# EasyEDA Pro project ProPrj_Custom Keyboard_2025-10-10.epro, board PCB
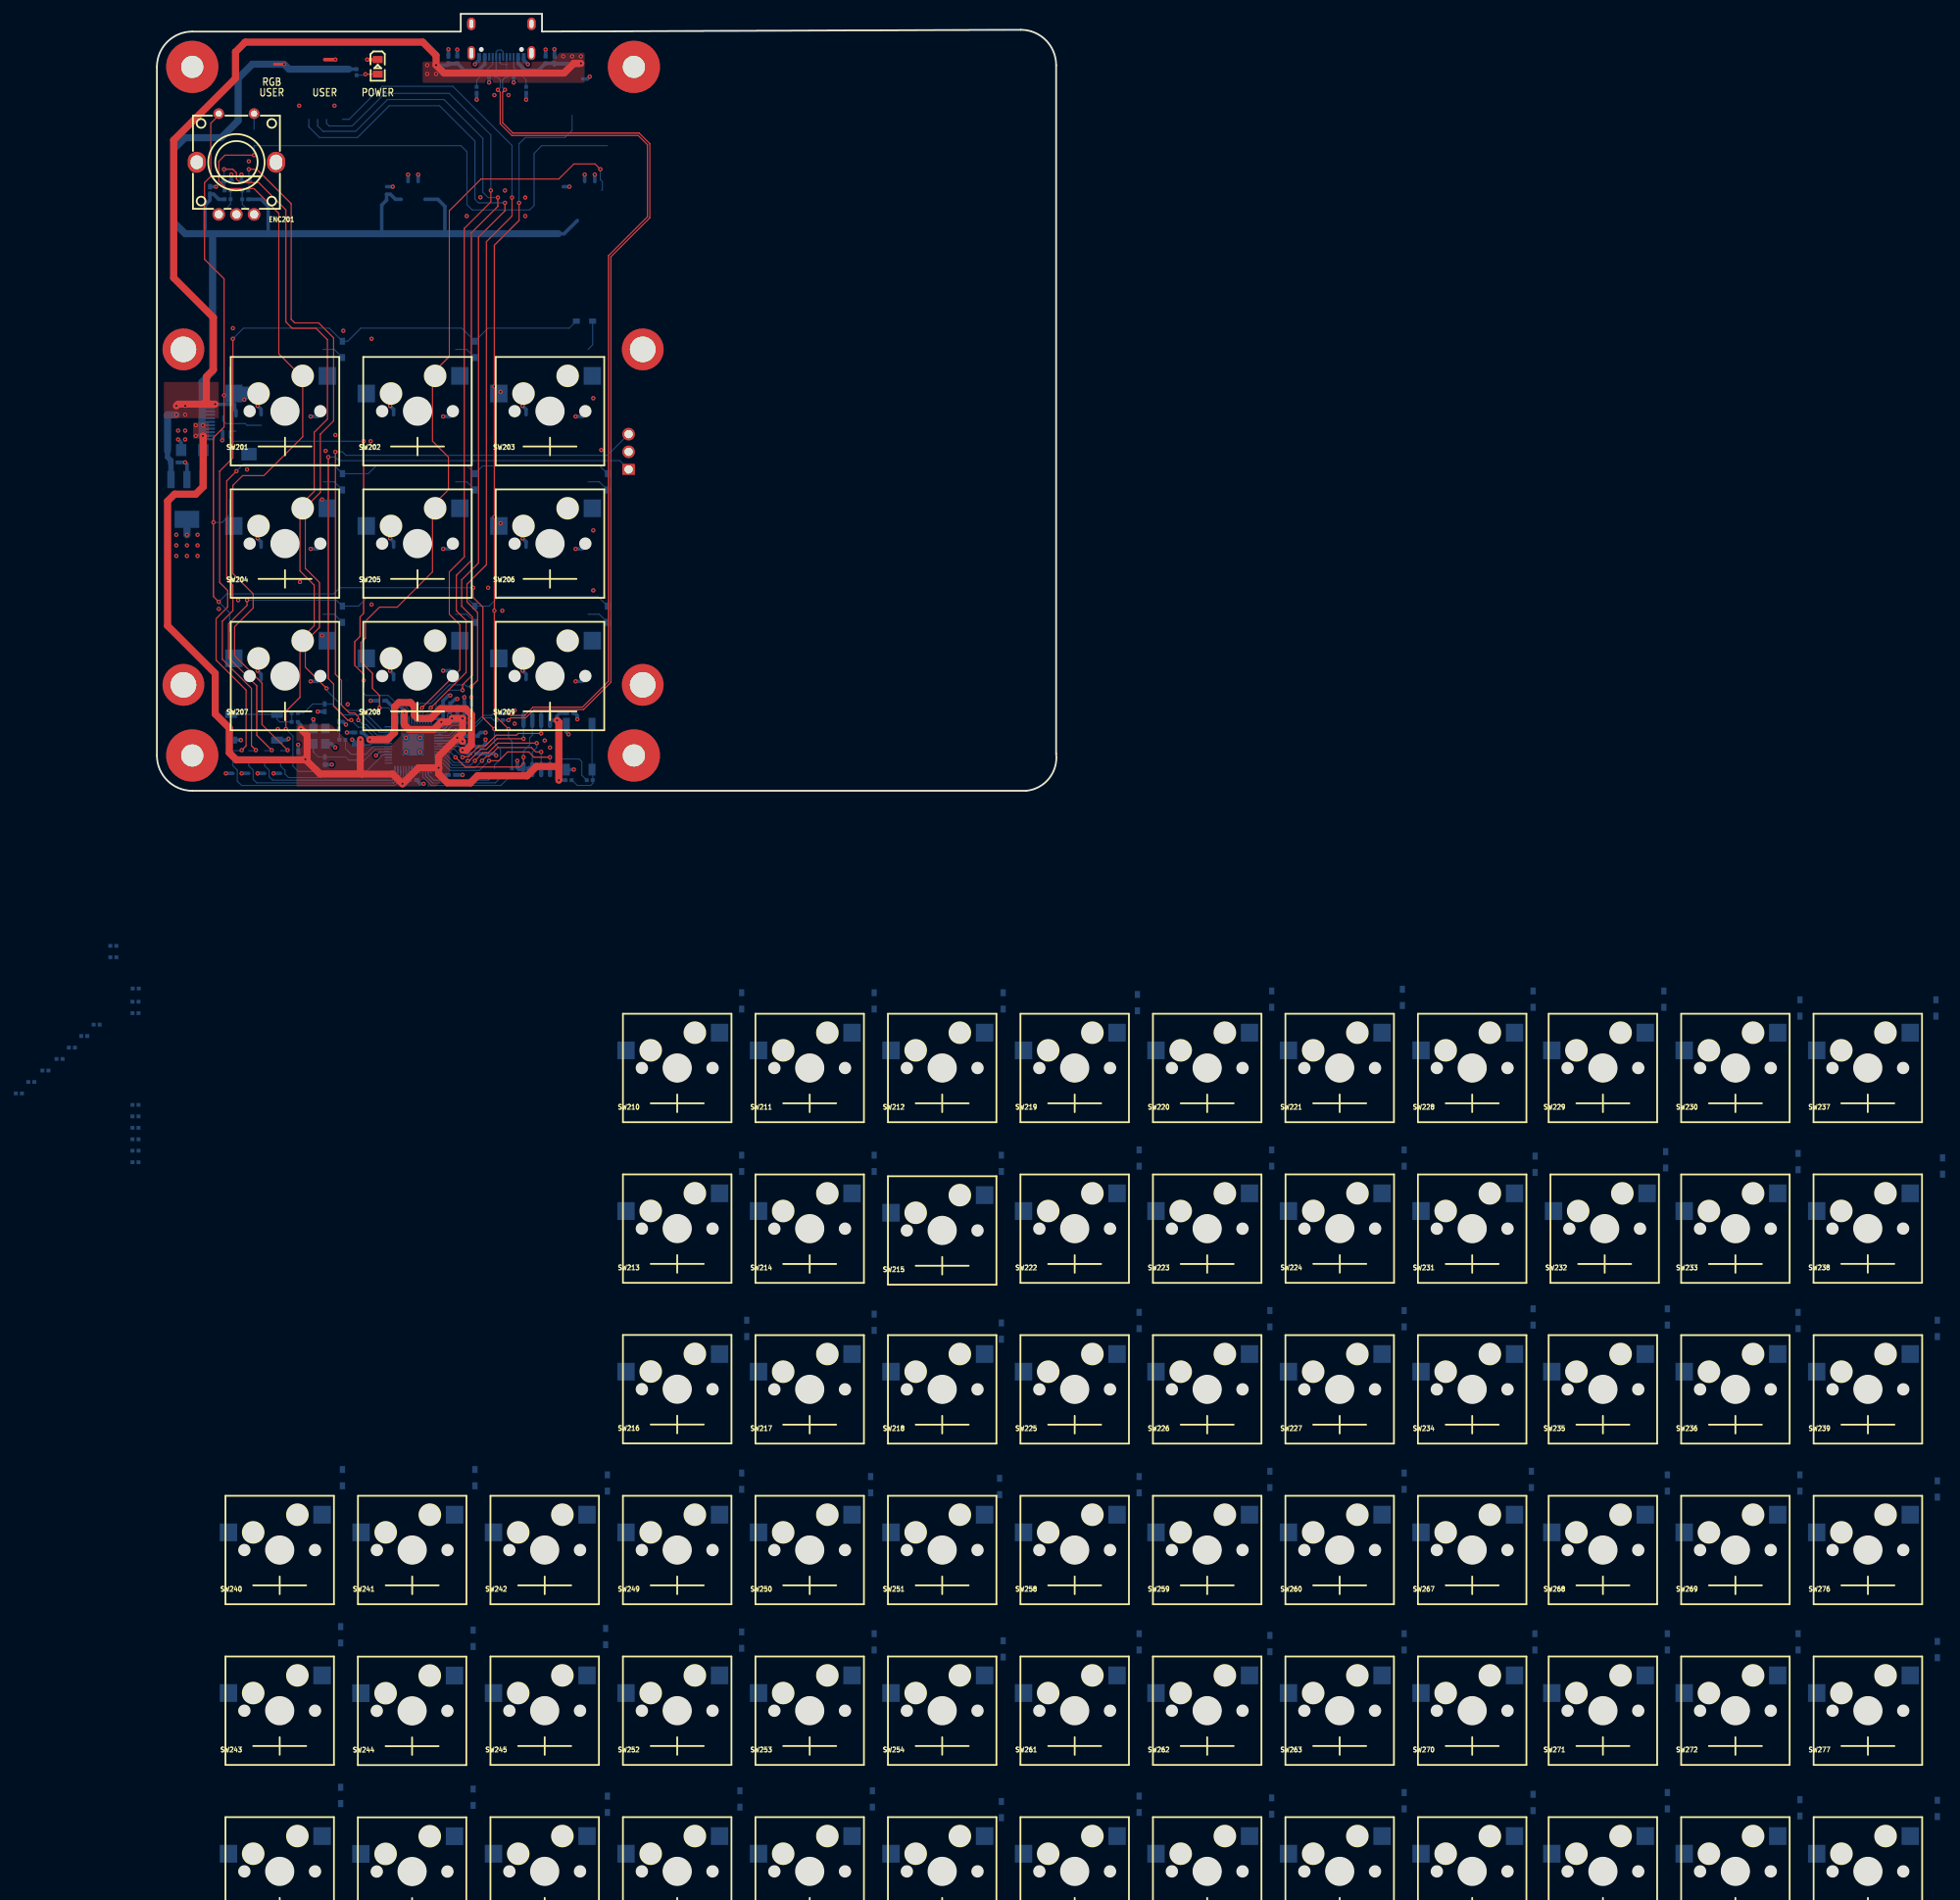
[diagram p2: board, top side]
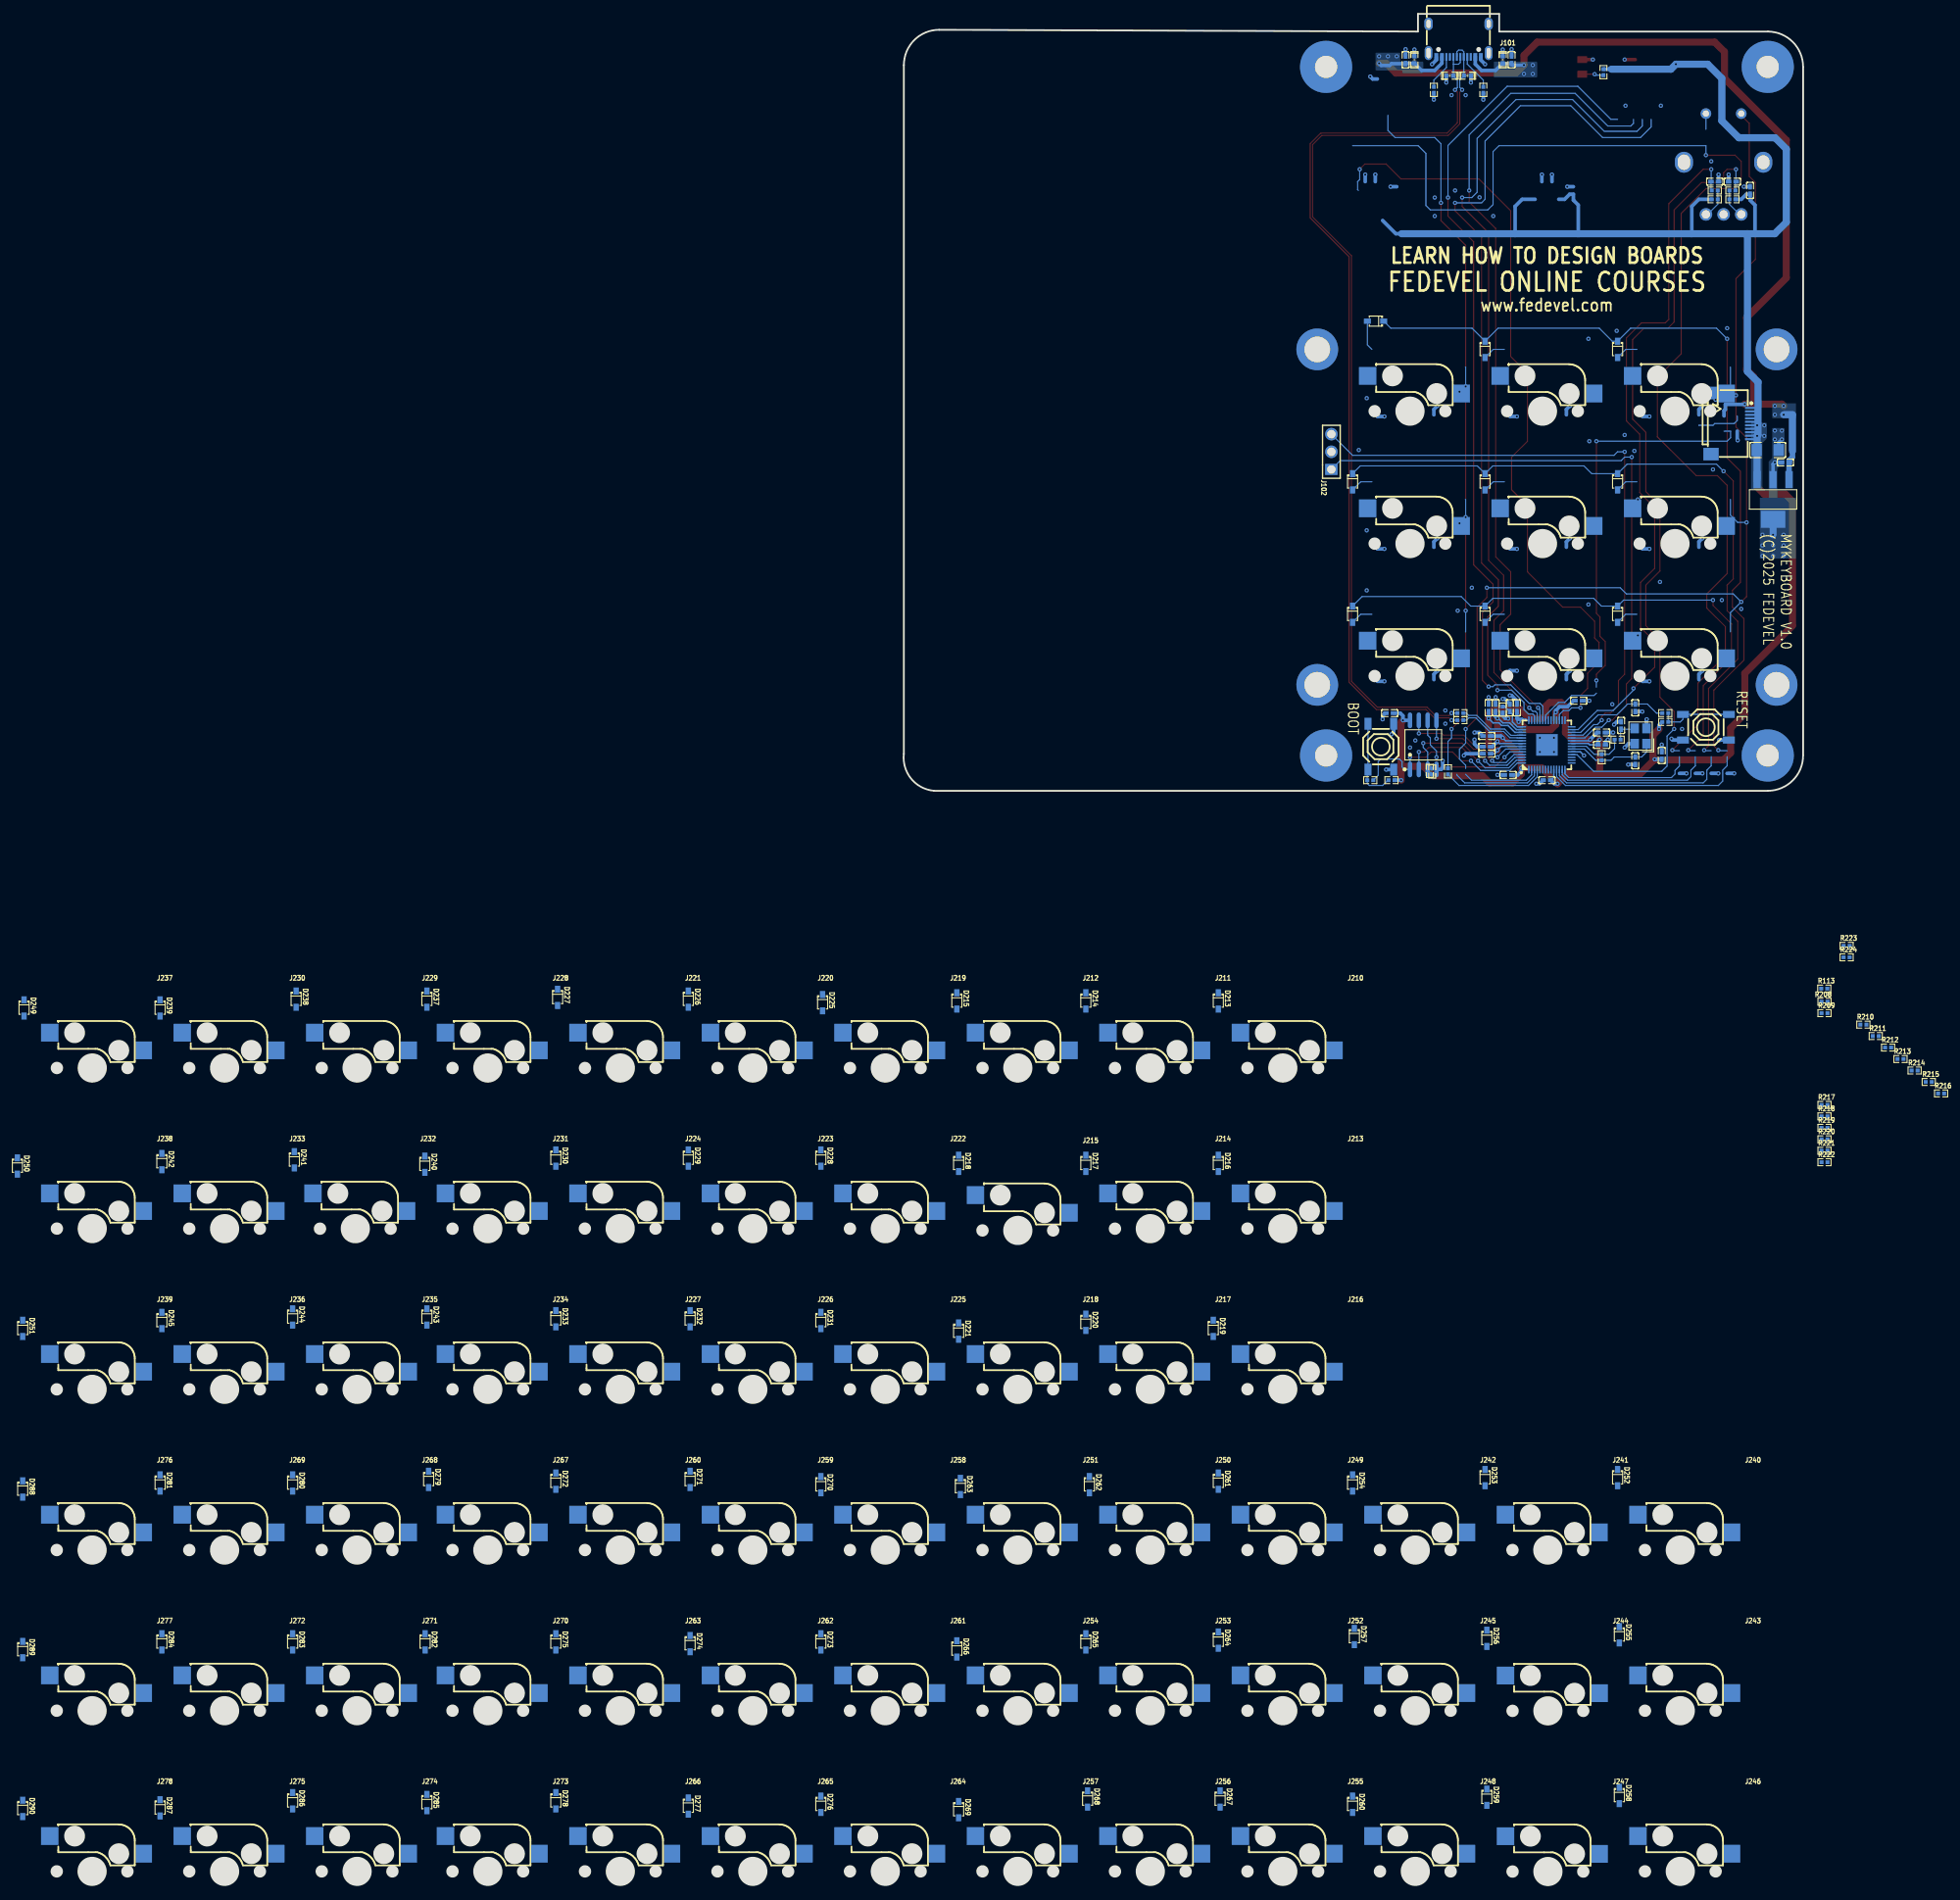
[diagram p3: board, bottom side, seen from below]

Outline 251.96 x 269.33 mm; copper layers: Top Layer, Inner1, Inner2, Bottom Layer. Coordinates in mm from the lower left corner of the outline.
Outline path: 0,261.71 0,162.65 arc(1.49,159.05) 5.08,157.57 124.97,157.57 arc(128.25,159.32) 129.29,162.9 129.29,261.96 arc(127.8,265.55) 124.21,267.04 55.37,266.79 55.37,269.33 43.69,269.33 43.69,266.79 5.08,266.79 arc(1.49,265.3) 0,261.71
Stack: Top Layer 0.035mm Outer layer copper thickness 1oz / Dielectric1 0.2104mm 7628 RC49% 8.6mil / Inner1 0.0152mm Inner layer copper thickness / Dielectric2 1.065mm 1.1mm H/HOZ Copper / Inner2 0.0152mm Inner layer copper thickness / Dielectric3 0.2104mm 7628 RC49% 8.6mil / Bottom Layer 0.035mm Outer layer copper thickness 1oz

## Design rules (mm)
net CON_USB_N: USB_CON
net CON_USB_P: USB_CON
net USB_N: USB
net USB_P: USB
template: User Custom Config
spacing copperThickness1oz (default): track to track 0.178, other pairs 0.076 to 0.305
spacing copperThickness2oz: track to track 0.203, other pairs 0.152 to 0.3
spacing copperThicknessInner0.5oz: track to track 0.089, other pairs 0.152 to 0.3
track width copperThickness1oz (default): min 0.152, default 0.203, max 2.54
track width copperThickness2oz: min 0.203, default 0.254, max 2.54
track width copperThickness0.5oz: min 0.089, default 0.254, max 2.54
differential pair differentialPair (default): width min 0.155, default 0.155, max 0.203; gap min 0.178, default 0.191
via viaSize (default): diameter min 0.61, default 0.61, max 10; hole min 0.305, default 0.305, max 6.299

## Placement (name value [footprint] x y rotation side)
C101  2.2uF  [C0402]  20.32 162.65 270 bottom
C102  100nF  [C0402]  45.47 165.44 180 bottom
C103  100nF  [C0402]  45.47 163.92 180 bottom
C104  100nF  [C0402]  41.15 169.5 270 bottom
C105  2.2uF  [C0402]  42.16 169.5 270 bottom
C106  2.2uF  [C0402]  44.2 169.5 270 bottom
C107  2.2uF  [C0402]  45.21 169.5 270 bottom
C108  100nF  [C0402]  45.47 162.9 180 bottom
C109  100nF  [C0402]  28.96 165.95 0 bottom
C111  1uF  [C0402]  2.54 204.81 180 bottom
C112  47uF  [C1206]  5.08 206.59 0 bottom
C113  100nF  [C0402]  32.26 170.52 0 bottom
C114  100nF  [C0402]  28.96 164.17 0 bottom
C115  100nF  [C0402]  36.83 159.09 180 bottom
C116  100nF  [C0402]  42.42 159.85 180 bottom
C118  1uF  [C0402]  41.91 262.72 270 bottom
C119  1uF  [C0402]  57.15 262.72 270 bottom
C123  15pF  [C0402]  24.13 161.88 270 bottom
C124  15pF  [C0402]  26.16 166.96 90 bottom
C126  100nF  [C0402]  59.44 168.74 180 bottom
C127  100nF  [C0402]  24.13 169.5 90 bottom
C201  2.2uF  [C0402]  7.62 243.93 270 bottom
C203  10nF  [C0402]  10.16 245.2 180 bottom
C204  10nF  [C0402]  12.7 245.2 0 bottom
D101  GG0402052R542P  [D0402-BI]  43.18 262.72 270 bottom
D102  GG0402052R542P  [D0402-BI]  55.88 262.72 270 bottom
D103  GG0402052R542P  [D0402-BI]  48.26 260.44 0 bottom
D104  GG0402052R542P  [D0402-BI]  50.8 260.44 180 bottom
D201  1N5819WS  [SOD-323_L1.8-W1.3-LS2.5-RD]  26.67 221.07 270 bottom
D202  1N5819WS  [SOD-323_L1.8-W1.3-LS2.5-RD]  45.72 221.07 270 bottom
D203  1N5819WS  [SOD-323_L1.8-W1.3-LS2.5-RD]  61.47 225.13 0 bottom
D204  1N5819WS  [SOD-323_L1.8-W1.3-LS2.5-RD]  26.67 202.02 270 bottom
D205  1N5819WS  [SOD-323_L1.8-W1.3-LS2.5-RD]  45.72 202.02 270 bottom
D206  1N5819WS  [SOD-323_L1.8-W1.3-LS2.5-RD]  64.77 202.02 270 bottom
D207  1N5819WS  [SOD-323_L1.8-W1.3-LS2.5-RD]  26.67 182.97 270 bottom
D208  1N5819WS  [SOD-323_L1.8-W1.3-LS2.5-RD]  45.72 182.97 270 bottom
D209  1N5819WS  [SOD-323_L1.8-W1.3-LS2.5-RD]  64.77 182.97 270 bottom
D213  1N5819WS  [SOD-323_L1.8-W1.3-LS2.5-RD]  84.07 127.34 270 bottom
D214  1N5819WS  [SOD-323_L1.8-W1.3-LS2.5-RD]  103.12 127.34 270 bottom
D215  1N5819WS  [SOD-323_L1.8-W1.3-LS2.5-RD]  121.67 127.34 270 bottom
D216  1N5819WS  [SOD-323_L1.8-W1.3-LS2.5-RD]  84.07 103.97 270 bottom
D217  1N5819WS  [SOD-323_L1.8-W1.3-LS2.5-RD]  103.12 103.97 270 bottom
D218  1N5819WS  [SOD-323_L1.8-W1.3-LS2.5-RD]  121.41 103.97 270 bottom
D219  1N5819WS  [SOD-323_L1.8-W1.3-LS2.5-RD]  84.8 80.23 270 bottom
D220  1N5819WS  [SOD-323_L1.8-W1.3-LS2.5-RD]  103.12 81.11 270 bottom
D221  1N5819WS  [SOD-323_L1.8-W1.3-LS2.5-RD]  121.41 79.84 270 bottom
D225  1N5819WS  [SOD-323_L1.8-W1.3-LS2.5-RD]  140.97 127.09 270 bottom
D226  1N5819WS  [SOD-323_L1.8-W1.3-LS2.5-RD]  160.27 127.59 270 bottom
D227  1N5819WS  [SOD-323_L1.8-W1.3-LS2.5-RD]  179.07 127.85 270 bottom
D228  1N5819WS  [SOD-323_L1.8-W1.3-LS2.5-RD]  141.22 104.73 270 bottom
D229  1N5819WS  [SOD-323_L1.8-W1.3-LS2.5-RD]  160.27 104.73 270 bottom
D230  1N5819WS  [SOD-323_L1.8-W1.3-LS2.5-RD]  179.32 104.73 270 bottom
D231  1N5819WS  [SOD-323_L1.8-W1.3-LS2.5-RD]  141.22 81.37 270 bottom
D232  1N5819WS  [SOD-323_L1.8-W1.3-LS2.5-RD]  160.02 81.62 270 bottom
D233  1N5819WS  [SOD-323_L1.8-W1.3-LS2.5-RD]  179.32 81.62 270 bottom
D237  1N5819WS  [SOD-323_L1.8-W1.3-LS2.5-RD]  197.87 127.59 270 bottom
D238  1N5819WS  [SOD-323_L1.8-W1.3-LS2.5-RD]  216.66 127.59 270 bottom
D239  1N5819WS  [SOD-323_L1.8-W1.3-LS2.5-RD]  236.22 126.32 270 bottom
D240  1N5819WS  [SOD-323_L1.8-W1.3-LS2.5-RD]  198.16 103.84 270 bottom
D241  1N5819WS  [SOD-323_L1.8-W1.3-LS2.5-RD]  216.92 104.48 270 bottom
D242  1N5819WS  [SOD-323_L1.8-W1.3-LS2.5-RD]  235.97 104.23 270 bottom
D243  1N5819WS  [SOD-323_L1.8-W1.3-LS2.5-RD]  197.87 81.87 270 bottom
D244  1N5819WS  [SOD-323_L1.8-W1.3-LS2.5-RD]  217.17 81.87 270 bottom
D245  1N5819WS  [SOD-323_L1.8-W1.3-LS2.5-RD]  235.97 81.37 270 bottom
D249  1N5819WS  [SOD-323_L1.8-W1.3-LS2.5-RD]  255.78 126.32 270 bottom
D250  1N5819WS  [SOD-323_L1.8-W1.3-LS2.5-RD]  256.74 103.59 270 bottom
D251  1N5819WS  [SOD-323_L1.8-W1.3-LS2.5-RD]  255.98 80.23 270 bottom
D252  1N5819WS  [SOD-323_L1.8-W1.3-LS2.5-RD]  26.67 58.76 270 bottom
D253  1N5819WS  [SOD-323_L1.8-W1.3-LS2.5-RD]  45.72 58.76 270 bottom
D254  1N5819WS  [SOD-323_L1.8-W1.3-LS2.5-RD]  64.77 58 270 bottom
D255  1N5819WS  [SOD-323_L1.8-W1.3-LS2.5-RD]  26.42 36.15 270 bottom
D256  1N5819WS  [SOD-323_L1.8-W1.3-LS2.5-RD]  45.47 35.65 270 bottom
D257  1N5819WS  [SOD-323_L1.8-W1.3-LS2.5-RD]  64.52 35.9 270 bottom
D258  1N5819WS  [SOD-323_L1.8-W1.3-LS2.5-RD]  26.42 13.04 270 bottom
D259  1N5819WS  [SOD-323_L1.8-W1.3-LS2.5-RD]  45.47 12.79 270 bottom
D260  1N5819WS  [SOD-323_L1.8-W1.3-LS2.5-RD]  64.77 11.77 270 bottom
D261  1N5819WS  [SOD-323_L1.8-W1.3-LS2.5-RD]  84.07 58.25 270 bottom
D262  1N5819WS  [SOD-323_L1.8-W1.3-LS2.5-RD]  102.62 57.74 270 bottom
D263  1N5819WS  [SOD-323_L1.8-W1.3-LS2.5-RD]  121.16 57.49 270 bottom
D264  1N5819WS  [SOD-323_L1.8-W1.3-LS2.5-RD]  84.07 35.39 270 bottom
D265  1N5819WS  [SOD-323_L1.8-W1.3-LS2.5-RD]  103.12 35.14 270 bottom
D266  1N5819WS  [SOD-323_L1.8-W1.3-LS2.5-RD]  121.67 34.12 270 bottom
D267  1N5819WS  [SOD-323_L1.8-W1.3-LS2.5-RD]  83.82 12.53 270 bottom
D268  1N5819WS  [SOD-323_L1.8-W1.3-LS2.5-RD]  102.87 12.53 270 bottom
D269  1N5819WS  [SOD-323_L1.8-W1.3-LS2.5-RD]  121.41 11.01 270 bottom
D270  1N5819WS  [SOD-323_L1.8-W1.3-LS2.5-RD]  141.22 57.74 270 bottom
D271  1N5819WS  [SOD-323_L1.8-W1.3-LS2.5-RD]  160.02 58.51 270 bottom
D272  1N5819WS  [SOD-323_L1.8-W1.3-LS2.5-RD]  179.32 58.25 270 bottom
D273  1N5819WS  [SOD-323_L1.8-W1.3-LS2.5-RD]  141.22 35.14 270 bottom
D274  1N5819WS  [SOD-323_L1.8-W1.3-LS2.5-RD]  160.02 34.88 270 bottom
D275  1N5819WS  [SOD-323_L1.8-W1.3-LS2.5-RD]  179.32 35.14 270 bottom
D276  1N5819WS  [SOD-323_L1.8-W1.3-LS2.5-RD]  141.22 11.77 270 bottom
D277  1N5819WS  [SOD-323_L1.8-W1.3-LS2.5-RD]  160.27 11.52 270 bottom
D278  1N5819WS  [SOD-323_L1.8-W1.3-LS2.5-RD]  179.32 12.28 270 bottom
D279  1N5819WS  [SOD-323_L1.8-W1.3-LS2.5-RD]  197.61 58.51 270 bottom
D280  1N5819WS  [SOD-323_L1.8-W1.3-LS2.5-RD]  217.17 58 270 bottom
D281  1N5819WS  [SOD-323_L1.8-W1.3-LS2.5-RD]  236.22 58 270 bottom
D282  1N5819WS  [SOD-323_L1.8-W1.3-LS2.5-RD]  198.12 35.14 270 bottom
D283  1N5819WS  [SOD-323_L1.8-W1.3-LS2.5-RD]  217.17 35.14 270 bottom
D284  1N5819WS  [SOD-323_L1.8-W1.3-LS2.5-RD]  235.97 35.14 270 bottom
D285  1N5819WS  [SOD-323_L1.8-W1.3-LS2.5-RD]  197.87 12.02 270 bottom
D286  1N5819WS  [SOD-323_L1.8-W1.3-LS2.5-RD]  217.17 12.28 270 bottom
D287  1N5819WS  [SOD-323_L1.8-W1.3-LS2.5-RD]  236.22 11.26 270 bottom
D288  1N5819WS  [SOD-323_L1.8-W1.3-LS2.5-RD]  255.98 57.13 270 bottom
D289  1N5819WS  [SOD-323_L1.8-W1.3-LS2.5-RD]  255.98 34.03 270 bottom
D290  1N5819WS  [SOD-323_L1.8-W1.3-LS2.5-RD]  255.98 11.18 270 bottom
ENC201  PEC12R-4120F-S0012  [SW-TH_PEC12R-4120F-S0012_1]  11.43 247.74 0 top
FPC1  FH28-10S-0.5SH(05)  [FFC-SMD_10P-P0.50_FH28-10S-0.5SH-05]  10.41 210.4 270 bottom
J101  TYPE-C 16PIN 2MD(073)  [USB-C-SMD_TYPE-C-6PIN-2MD-073]  49.53 265.52 0 bottom
J102  2.54-1*3P针  [HDR-TH_3P-P2.54-V-M-1]  67.82 206.33 90 bottom
J201  CPG151101S11-16  [SMD_KEYBOARD-SW_1]  17.78 215.99 0 bottom
J202  CPG151101S11-16  [SMD_KEYBOARD-SW_1]  36.83 215.99 0 bottom
J203  CPG151101S11-16  [SMD_KEYBOARD-SW_1]  55.88 215.99 0 bottom
J204  CPG151101S11-16  [SMD_KEYBOARD-SW_1]  17.78 196.94 0 bottom
J205  CPG151101S11-16  [SMD_KEYBOARD-SW_1]  36.83 196.94 0 bottom
J206  CPG151101S11-16  [SMD_KEYBOARD-SW_1]  55.88 196.94 0 bottom
J207  CPG151101S11-16  [SMD_KEYBOARD-SW_1]  17.78 177.89 0 bottom
J208  CPG151101S11-16  [SMD_KEYBOARD-SW_1]  36.83 177.89 0 bottom
J209  CPG151101S11-16  [SMD_KEYBOARD-SW_1]  55.88 177.89 0 bottom
J210  CPG151101S11-16  [SMD_KEYBOARD-SW_1]  74.17 121.5 0 bottom
J211  CPG151101S11-16  [SMD_KEYBOARD-SW_1]  93.22 121.5 0 bottom
J212  CPG151101S11-16  [SMD_KEYBOARD-SW_1]  112.27 121.5 0 bottom
J213  CPG151101S11-16  [SMD_KEYBOARD-SW_1]  74.17 98.38 0 bottom
J214  CPG151101S11-16  [SMD_KEYBOARD-SW_1]  93.22 98.38 0 bottom
J215  CPG151101S11-16  [SMD_KEYBOARD-SW_1]  112.27 98.13 0 bottom
J216  CPG151101S11-16  [SMD_KEYBOARD-SW_1]  74.17 75.27 0 bottom
J217  CPG151101S11-16  [SMD_KEYBOARD-SW_1]  93.22 75.27 0 bottom
J218  CPG151101S11-16  [SMD_KEYBOARD-SW_1]  112.27 75.27 0 bottom
J219  CPG151101S11-16  [SMD_KEYBOARD-SW_1]  131.32 121.5 0 bottom
J220  CPG151101S11-16  [SMD_KEYBOARD-SW_1]  150.37 121.5 0 bottom
J221  CPG151101S11-16  [SMD_KEYBOARD-SW_1]  169.42 121.5 0 bottom
J222  CPG151101S11-16  [SMD_KEYBOARD-SW_1]  131.32 98.38 0 bottom
J223  CPG151101S11-16  [SMD_KEYBOARD-SW_1]  150.37 98.38 0 bottom
J224  CPG151101S11-16  [SMD_KEYBOARD-SW_1]  169.42 98.38 0 bottom
J225  CPG151101S11-16  [SMD_KEYBOARD-SW_1]  131.32 75.27 0 bottom
J226  CPG151101S11-16  [SMD_KEYBOARD-SW_1]  150.37 75.27 0 bottom
J227  CPG151101S11-16  [SMD_KEYBOARD-SW_1]  169.42 75.27 0 bottom
J228  CPG151101S11-16  [SMD_KEYBOARD-SW_1]  188.47 121.5 0 bottom
J229  CPG151101S11-16  [SMD_KEYBOARD-SW_1]  207.26 121.5 0 bottom
J230  CPG151101S11-16  [SMD_KEYBOARD-SW_1]  226.31 121.5 0 bottom
J231  CPG151101S11-16  [SMD_KEYBOARD-SW_1]  188.47 98.38 0 bottom
J232  CPG151101S11-16  [SMD_KEYBOARD-SW_1]  207.52 98.38 0 bottom
J233  CPG151101S11-16  [SMD_KEYBOARD-SW_1]  226.31 98.38 0 bottom
J234  CPG151101S11-16  [SMD_KEYBOARD-SW_1]  188.47 75.27 0 bottom
J235  CPG151101S11-16  [SMD_KEYBOARD-SW_1]  207.26 75.27 0 bottom
J236  CPG151101S11-16  [SMD_KEYBOARD-SW_1]  226.31 75.27 0 bottom
J237  CPG151101S11-16  [SMD_KEYBOARD-SW_1]  245.36 121.5 0 bottom
J238  CPG151101S11-16  [SMD_KEYBOARD-SW_1]  245.36 98.38 0 bottom
J239  CPG151101S11-16  [SMD_KEYBOARD-SW_1]  245.36 75.27 0 bottom
J240  CPG151101S11-16  [SMD_KEYBOARD-SW_1]  17.02 52.16 0 bottom
J241  CPG151101S11-16  [SMD_KEYBOARD-SW_1]  36.07 52.16 0 bottom
J242  CPG151101S11-16  [SMD_KEYBOARD-SW_1]  55.12 52.16 0 bottom
J243  CPG151101S11-16  [SMD_KEYBOARD-SW_1]  17.02 29.04 0 bottom
J244  CPG151101S11-16  [SMD_KEYBOARD-SW_1]  36.05 29.02 0 bottom
J245  CPG151101S11-16  [SMD_KEYBOARD-SW_1]  55.12 29.04 0 bottom
J246  CPG151101S11-16  [SMD_KEYBOARD-SW_1]  17.02 5.93 0 bottom
J247  CPG151101S11-16  [SMD_KEYBOARD-SW_1]  36.05 5.91 0 bottom
J248  CPG151101S11-16  [SMD_KEYBOARD-SW_1]  55.12 5.93 0 bottom
J249  CPG151101S11-16  [SMD_KEYBOARD-SW_1]  74.17 52.16 0 bottom
J250  CPG151101S11-16  [SMD_KEYBOARD-SW_1]  93.22 52.16 0 bottom
J251  CPG151101S11-16  [SMD_KEYBOARD-SW_1]  112.27 52.16 0 bottom
J252  CPG151101S11-16  [SMD_KEYBOARD-SW_1]  74.17 29.04 0 bottom
J253  CPG151101S11-16  [SMD_KEYBOARD-SW_1]  93.22 29.04 0 bottom
J254  CPG151101S11-16  [SMD_KEYBOARD-SW_1]  112.27 29.04 0 bottom
J255  CPG151101S11-16  [SMD_KEYBOARD-SW_1]  74.17 5.93 0 bottom
J256  CPG151101S11-16  [SMD_KEYBOARD-SW_1]  93.22 5.93 0 bottom
J257  CPG151101S11-16  [SMD_KEYBOARD-SW_1]  112.27 5.93 0 bottom
J258  CPG151101S11-16  [SMD_KEYBOARD-SW_1]  131.32 52.16 0 bottom
J259  CPG151101S11-16  [SMD_KEYBOARD-SW_1]  150.37 52.16 0 bottom
J260  CPG151101S11-16  [SMD_KEYBOARD-SW_1]  169.42 52.16 0 bottom
J261  CPG151101S11-16  [SMD_KEYBOARD-SW_1]  131.32 29.04 0 bottom
J262  CPG151101S11-16  [SMD_KEYBOARD-SW_1]  150.37 29.04 0 bottom
J263  CPG151101S11-16  [SMD_KEYBOARD-SW_1]  169.42 29.04 0 bottom
J264  CPG151101S11-16  [SMD_KEYBOARD-SW_1]  131.32 5.93 0 bottom
J265  CPG151101S11-16  [SMD_KEYBOARD-SW_1]  150.37 5.93 0 bottom
J266  CPG151101S11-16  [SMD_KEYBOARD-SW_1]  169.42 5.93 0 bottom
J267  CPG151101S11-16  [SMD_KEYBOARD-SW_1]  188.47 52.16 0 bottom
J268  CPG151101S11-16  [SMD_KEYBOARD-SW_1]  207.26 52.16 0 bottom
J269  CPG151101S11-16  [SMD_KEYBOARD-SW_1]  226.31 52.16 0 bottom
J270  CPG151101S11-16  [SMD_KEYBOARD-SW_1]  188.47 29.04 0 bottom
J271  CPG151101S11-16  [SMD_KEYBOARD-SW_1]  207.26 29.04 0 bottom
J272  CPG151101S11-16  [SMD_KEYBOARD-SW_1]  226.31 29.04 0 bottom
J273  CPG151101S11-16  [SMD_KEYBOARD-SW_1]  188.47 5.93 0 bottom
J274  CPG151101S11-16  [SMD_KEYBOARD-SW_1]  207.26 5.93 0 bottom
J275  CPG151101S11-16  [SMD_KEYBOARD-SW_1]  226.31 5.93 0 bottom
J276  CPG151101S11-16  [SMD_KEYBOARD-SW_1]  245.36 52.16 0 bottom
J277  CPG151101S11-16  [SMD_KEYBOARD-SW_1]  245.36 29.04 0 bottom
J278  CPG151101S11-16  [SMD_KEYBOARD-SW_1]  245.36 5.93 0 bottom
LED102  KT-0805G  [LED0805-R-RD]  31.75 261.71 270 top
MH201  STANDOFF_M2.5x3.5MM  [STANDOFF_M2.5x3.5MM_RF_v1.0]  3.81 172.81 0 top
MH202  STANDOFF_M2.5x3.5MM  [STANDOFF_M2.5x3.5MM_RF_v1.0]  69.85 172.81 0 top
MH203  STANDOFF_M2.5x3.5MM  [STANDOFF_M2.5x3.5MM_RF_v1.0]  3.81 221.07 0 top
MH204  STANDOFF_M2.5x3.5MM  [STANDOFF_M2.5x3.5MM_RF_v1.0]  69.85 221.07 0 top
MH205  -  [MH_7.5X3.2MM_RF_v1.0]  5.08 162.65 0 top
MH206  -  [MH_7.5X3.2MM_RF_v1.0]  68.58 162.65 0 top
MH207  -  [MH_7.5X3.2MM_RF_v1.0]  5.08 261.71 0 top
MH208  -  [MH_7.5X3.2MM_RF_v1.0]  68.58 261.71 0 top
R101  200Ω  [R0402]  43.18 169.25 90 bottom
R104  1kΩ  [R0402]  28.7 260.94 90 bottom
R108  27Ω  [R0402]  53.66 160.43 90 bottom
R109  27Ω  [R0402]  49.28 168.74 180 bottom
R110  27Ω  [R0402]  53.33 160.34 90 bottom
R111  27Ω  [R0402]  49.28 167.73 180 bottom
R112  27Ω  [R0402]  51.05 160.36 90 bottom
R113  27Ω  [R0402]  -3.05 129.12 180 bottom
R118  5.1kΩ  [R0402]  53.09 258.4 90 bottom
R119  5.1kΩ  [R0402]  45.97 258.4 90 bottom
R120  1MΩ  [R0402]  28.96 162.39 270 bottom
R121  1kΩ  [R0402]  26.67 164.93 0 bottom
R122  100kΩ  [R0402]  59.18 159.09 180 bottom
R123  10kΩ  [R0402]  19.81 167.47 0 bottom
R124  1kΩ  [R0402]  62.23 159.09 180 bottom
R125  27Ω  [R0402]  19.81 168.74 0 bottom
R201  10kΩ  [R0402]  10.16 242.66 180 bottom
R202  10kΩ  [R0402]  12.7 242.66 0 bottom
R205  10kΩ  [R0402]  10.16 243.93 0 bottom
R207  10kΩ  [R0402]  12.7 243.93 180 bottom
R208  27Ω  [R0402]  -3.08 127.23 180 bottom
R209  27Ω  [R0402]  -3.08 125.58 180 bottom
R210  27Ω  [R0402]  -8.67 123.93 180 bottom
R211  27Ω  [R0402]  -10.45 122.28 180 bottom
R212  27Ω  [R0402]  -12.23 120.63 180 bottom
R213  27Ω  [R0402]  -14 118.98 180 bottom
R214  27Ω  [R0402]  -16.04 117.33 180 bottom
R215  27Ω  [R0402]  -18.07 115.68 180 bottom
R216  27Ω  [R0402]  -19.85 114.03 180 bottom
R217  27Ω  [R0402]  -3.08 112.38 180 bottom
R218  27Ω  [R0402]  -3.08 110.73 180 bottom
R219  27Ω  [R0402]  -3.08 109.08 180 bottom
R220  27Ω  [R0402]  -3.08 107.43 180 bottom
R221  27Ω  [R0402]  -3.08 105.78 180 bottom
R222  27Ω  [R0402]  -3.08 104.13 180 bottom
R223  10kΩ  [R0402]  -6.26 135.26 180 bottom
R224  10kΩ  [R0402]  -6.26 133.61 180 bottom
SW101  TS-1187A-B-A-B  [SW-SMD_4P-L5.1-W5.1-P3.70-LS6.5-TL-2]  60.71 163.92 270 bottom
SW102  TS-1187A-B-A-B  [SW-SMD_4P-L5.1-W5.1-P3.70-LS6.5-TL-2]  13.97 166.71 0 bottom
SW201  CPG151101S21  [KEY-TH_CPG1511F01S0X_1]  17.78 215.99 0 top
SW202  CPG151101S21  [KEY-TH_CPG1511F01S0X_1]  36.83 215.99 0 top
SW203  CPG151101S21  [KEY-TH_CPG1511F01S0X_1]  55.88 215.99 0 top
SW204  CPG151101S21  [KEY-TH_CPG1511F01S0X_1]  17.78 196.94 0 top
SW205  CPG151101S21  [KEY-TH_CPG1511F01S0X_1]  36.83 196.94 0 top
SW206  CPG151101S21  [KEY-TH_CPG1511F01S0X_1]  55.88 196.94 0 top
SW207  CPG151101S21  [KEY-TH_CPG1511F01S0X_1]  17.78 177.89 0 top
SW208  CPG151101S21  [KEY-TH_CPG1511F01S0X_1]  36.83 177.89 0 top
SW209  CPG151101S21  [KEY-TH_CPG1511F01S0X_1]  55.88 177.89 0 top
SW210  CPG151101S21  [KEY-TH_CPG1511F01S0X_1]  74.17 121.5 0 top
SW211  CPG151101S21  [KEY-TH_CPG1511F01S0X_1]  93.22 121.5 0 top
SW212  CPG151101S21  [KEY-TH_CPG1511F01S0X_1]  112.27 121.5 0 top
SW213  CPG151101S21  [KEY-TH_CPG1511F01S0X_1]  74.17 98.4 0 top
SW214  CPG151101S21  [KEY-TH_CPG1511F01S0X_1]  93.22 98.38 0 top
SW215  CPG151101S21  [KEY-TH_CPG1511F01S0X_1]  112.27 98.13 0 top
SW216  CPG151101S21  [KEY-TH_CPG1511F01S0X_1]  74.17 75.29 0 top
SW217  CPG151101S21  [KEY-TH_CPG1511F01S0X_1]  93.22 75.27 0 top
SW218  CPG151101S21  [KEY-TH_CPG1511F01S0X_1]  112.27 75.27 0 top
SW219  CPG151101S21  [KEY-TH_CPG1511F01S0X_1]  131.32 121.5 0 top
SW220  CPG151101S21  [KEY-TH_CPG1511F01S0X_1]  150.37 121.5 0 top
SW221  CPG151101S21  [KEY-TH_CPG1511F01S0X_1]  169.42 121.5 0 top
SW222  CPG151101S21  [KEY-TH_CPG1511F01S0X_1]  131.32 98.38 0 top
SW223  CPG151101S21  [KEY-TH_CPG1511F01S0X_1]  150.37 98.38 0 top
SW224  CPG151101S21  [KEY-TH_CPG1511F01S0X_1]  169.44 98.4 0 top
SW225  CPG151101S21  [KEY-TH_CPG1511F01S0X_1]  131.32 75.27 0 top
SW226  CPG151101S21  [KEY-TH_CPG1511F01S0X_1]  150.37 75.27 0 top
SW227  CPG151101S21  [KEY-TH_CPG1511F01S0X_1]  169.42 75.27 0 top
SW228  CPG151101S21  [KEY-TH_CPG1511F01S0X_1]  188.47 121.5 0 top
SW229  CPG151101S21  [KEY-TH_CPG1511F01S0X_1]  207.26 121.5 0 top
SW230  CPG151101S21  [KEY-TH_CPG1511F01S0X_1]  226.31 121.5 0 top
SW231  CPG151101S21  [KEY-TH_CPG1511F01S0X_1]  188.47 98.38 0 top
SW232  CPG151101S21  [KEY-TH_CPG1511F01S0X_1]  207.52 98.38 0 top
SW233  CPG151101S21  [KEY-TH_CPG1511F01S0X_1]  226.31 98.38 0 top
SW234  CPG151101S21  [KEY-TH_CPG1511F01S0X_1]  188.47 75.27 0 top
SW235  CPG151101S21  [KEY-TH_CPG1511F01S0X_1]  207.26 75.27 0 top
SW236  CPG151101S21  [KEY-TH_CPG1511F01S0X_1]  226.31 75.27 0 top
SW237  CPG151101S21  [KEY-TH_CPG1511F01S0X_1]  245.34 121.5 0 top
SW238  CPG151101S21  [KEY-TH_CPG1511F01S0X_1]  245.34 98.4 0 top
SW239  CPG151101S21  [KEY-TH_CPG1511F01S0X_1]  245.36 75.27 0 top
SW240  CPG151101S21  [KEY-TH_CPG1511F01S0X_1]  17.02 52.16 0 top
SW241  CPG151101S21  [KEY-TH_CPG1511F01S0X_1]  36.07 52.16 0 top
SW242  CPG151101S21  [KEY-TH_CPG1511F01S0X_1]  55.12 52.16 0 top
SW243  CPG151101S21  [KEY-TH_CPG1511F01S0X_1]  17.02 29.04 0 top
SW244  CPG151101S21  [KEY-TH_CPG1511F01S0X_1]  36.05 29.02 0 top
SW245  CPG151101S21  [KEY-TH_CPG1511F01S0X_1]  55.12 29.04 0 top
SW246  CPG151101S21  [KEY-TH_CPG1511F01S0X_1]  17.02 5.93 0 top
SW247  CPG151101S21  [KEY-TH_CPG1511F01S0X_1]  36.05 5.91 0 top
SW248  CPG151101S21  [KEY-TH_CPG1511F01S0X_1]  55.12 5.93 0 top
SW249  CPG151101S21  [KEY-TH_CPG1511F01S0X_1]  74.17 52.16 0 top
SW250  CPG151101S21  [KEY-TH_CPG1511F01S0X_1]  93.22 52.16 0 top
SW251  CPG151101S21  [KEY-TH_CPG1511F01S0X_1]  112.27 52.16 0 top
SW252  CPG151101S21  [KEY-TH_CPG1511F01S0X_1]  74.17 29.04 0 top
SW253  CPG151101S21  [KEY-TH_CPG1511F01S0X_1]  93.22 29.04 0 top
SW254  CPG151101S21  [KEY-TH_CPG1511F01S0X_1]  112.27 29.04 0 top
SW255  CPG151101S21  [KEY-TH_CPG1511F01S0X_1]  74.17 5.93 0 top
SW256  CPG151101S21  [KEY-TH_CPG1511F01S0X_1]  93.22 5.93 0 top
SW257  CPG151101S21  [KEY-TH_CPG1511F01S0X_1]  112.27 5.93 0 top
SW258  CPG151101S21  [KEY-TH_CPG1511F01S0X_1]  131.32 52.16 0 top
SW259  CPG151101S21  [KEY-TH_CPG1511F01S0X_1]  150.37 52.16 0 top
SW260  CPG151101S21  [KEY-TH_CPG1511F01S0X_1]  169.42 52.16 0 top
SW261  CPG151101S21  [KEY-TH_CPG1511F01S0X_1]  131.32 29.04 0 top
SW262  CPG151101S21  [KEY-TH_CPG1511F01S0X_1]  150.37 29.04 0 top
SW263  CPG151101S21  [KEY-TH_CPG1511F01S0X_1]  169.42 29.04 0 top
SW264  CPG151101S21  [KEY-TH_CPG1511F01S0X_1]  131.32 5.93 0 top
SW265  CPG151101S21  [KEY-TH_CPG1511F01S0X_1]  150.37 5.93 0 top
SW266  CPG151101S21  [KEY-TH_CPG1511F01S0X_1]  169.42 5.93 0 top
SW267  CPG151101S21  [KEY-TH_CPG1511F01S0X_1]  188.47 52.16 0 top
SW268  CPG151101S21  [KEY-TH_CPG1511F01S0X_1]  207.26 52.16 0 top
SW269  CPG151101S21  [KEY-TH_CPG1511F01S0X_1]  226.31 52.16 0 top
SW270  CPG151101S21  [KEY-TH_CPG1511F01S0X_1]  188.47 29.04 0 top
SW271  CPG151101S21  [KEY-TH_CPG1511F01S0X_1]  207.26 29.04 0 top
SW272  CPG151101S21  [KEY-TH_CPG1511F01S0X_1]  226.31 29.04 0 top
SW273  CPG151101S21  [KEY-TH_CPG1511F01S0X_1]  188.47 5.93 0 top
SW274  CPG151101S21  [KEY-TH_CPG1511F01S0X_1]  207.26 5.93 0 top
SW275  CPG151101S21  [KEY-TH_CPG1511F01S0X_1]  226.31 5.93 0 top
SW276  CPG151101S21  [KEY-TH_CPG1511F01S0X_1]  245.36 52.16 0 top
SW277  CPG151101S21  [KEY-TH_CPG1511F01S0X_1]  245.36 29.04 0 top
SW278  CPG151101S21  [KEY-TH_CPG1511F01S0X_1]  245.36 5.93 0 top
U101  RP2040  [LQFN-56_L7.0-W7.0-P0.4-EP_1]  36.83 164.17 90 bottom
U102  LM3940IMP-3.3/NOPB  [SOT-223_L6.5-W3.5-P2.30-LS7.0-BR]  4.32 199.48 90 bottom
U104  W25Q128JVSIQ  [SOIC-8_L5.3-W5.3-P1.27-LS8.0-BL]  54.61 164.17 180 bottom
Y101  ABM8-272-T3  [CRYSTAL-SMD_4P-L3.2-W2.5-BL]  23.37 165.44 90 bottom

## Footprints (pads in the part's own frame, mm; a bottom-side part is the same pattern mirrored in y, then rotated)
C0402
  rect 0.79x0.54 smd: 1(-0.545,0) 2(0.545,0)
C1206
  rect 1.485x1.728 smd: 1(-1.593,0) 2(1.593,0)
CRYSTAL-SMD_4P-L3.2-W2.5-BL
  rect 1.4x1.2 smd: 1(-1.1,-0.85) 2(1.1,-0.85) 3(1.1,0.85) 4(-1.1,0.85)
D0402-BI
  rect 0.6x0.6 smd: 1(-0.5,0) 2(0.5,0)
FFC-SMD_10P-P0.50_FH28-10S-0.5SH-05
  rect 0.3x1.5 smd: 1(-2.25,2.825) 2(-1.75,2.825) 3(-1.25,2.825) 4(-0.75,2.825) 5(-0.25,2.825) 6(0.25,2.825) 7(0.75,2.825) 8(1.25,2.825) 9(1.75,2.825) 10(2.25,2.825)
  rect 1.8x2.2 smd: 11(4.4,-2.825) 12(-4.4,-2.825)
HDR-TH_3P-P2.54-V-M-1
  rect 1.575x1.8 hole 1.2: 1(-2.54,0)
  round 1.8 hole 1.2: 2(0,0) 3(2.54,0)
LED0805-R-RD
  rect 1x1.399 smd: 1(1.05,0) 2(-1.05,0)
LQFN-56_L7.0-W7.0-P0.4-EP_1
  rect 1.1x0.2 smd: 1(-3.55,2.6) 2(-3.55,2.2) 3(-3.55,1.8) 4(-3.55,1.4) 5(-3.55,1) 6(-3.55,0.6) 7(-3.55,0.2) 8(-3.55,-0.2) 9(-3.55,-0.6) 10(-3.55,-1) 11(-3.55,-1.4) 12(-3.55,-1.8) 13(-3.55,-2.2) 14(-3.55,-2.6) 29(3.55,-2.6) 30(3.55,-2.2) 31(3.55,-1.8) 32(3.55,-1.4) 33(3.55,-1) 34(3.55,-0.6) 35(3.55,-0.2) 36(3.55,0.2) 37(3.55,0.6) 38(3.55,1) 39(3.55,1.4) 40(3.55,1.8) 41(3.55,2.2) 42(3.55,2.6)
  rect 0.2x1.1 smd: 15(-2.6,-3.55) 16(-2.2,-3.55) 17(-1.8,-3.55) 18(-1.4,-3.55) 19(-1,-3.55) 20(-0.6,-3.55) 21(-0.2,-3.55) 22(0.2,-3.55) 23(0.6,-3.55) 24(1,-3.55) 25(1.4,-3.55) 26(1.8,-3.55) 27(2.2,-3.55) 28(2.6,-3.55) 43(2.6,3.55) 44(2.2,3.55) 45(1.8,3.55) 46(1.4,3.55) 47(1,3.55) 48(0.6,3.55) 49(0.2,3.55) 50(-0.2,3.55) 51(-0.6,3.55) 52(-1,3.55) 53(-1.4,3.55) 54(-1.8,3.55) 55(-2.2,3.55) 56(-2.6,3.55)
  rect 3.1x3.1 smd: 57(0,0)
MH_7.5X3.2MM_RF_v1.0
  round 7.5 hole 3.2: 1(0,0)
R0402
  rect 0.566x0.54 smd: 1(-0.433,0) 2(0.433,0)
SMD_KEYBOARD-SW_1
  rect 2.5x2.55 smd: 1(-6.725,1.27) 2(6.725,-1.27)
SOD-323_L1.8-W1.3-LS2.5-RD
  rect 1x0.75 smd: 1(-1.173,0) 2(1.173,0)
SOIC-8_L5.3-W5.3-P1.27-LS8.0-BL
  oval 0.63x2.25 smd: 1(-1.905,-3.53) 2(-0.635,-3.53) 3(0.635,-3.53) 4(1.905,-3.53) 5(1.905,3.53) 6(0.635,3.53) 7(-0.635,3.53) 8(-1.905,3.53)
SOT-223_L6.5-W3.5-P2.30-LS7.0-BR
  rect 2.465x1.05 smd: 1(2.857,-2.3) 2(2.857,0) 3(2.857,2.3)
  rect 2.465x3.54 smd: 4(-2.857,0)
STANDOFF_M2.5x3.5MM_RF_v1.0
  round 6 hole 3.7: 1(0,0)
SW-SMD_4P-L5.1-W5.1-P3.70-LS6.5-TL-2
  rect 1.7x1 smd: 1(-3.3,1.85) 2(3.3,1.85) 3(-3.3,-1.85) 4(3.3,-1.85)
SW-TH_PEC12R-4120F-S0012_1
  round 1.524 hole 0.914: 1(-2.54,7.25) 2(2.54,7.25)
  oval 2.6x3 hole 1.8x2.2: 3(5.7,0.25)
  oval 2.6x3 hole 1.8x2: 4(-5.7,0.25)
  round 1.8 hole 1.2: A(-2.54,-7.25) B(2.54,-7.25) C(0,-7.25)
USB-C-SMD_TYPE-C-6PIN-2MD-073
  rect 0.55x1.1 smd: 1(-3.2,2.375) 2(-2.4,2.375) 11(2.4,2.375) 12(3.2,2.375)
  rect 0.3x1.1 smd: 3(-1.75,2.375) 4(-1.25,2.375) 5(-0.75,2.375) 6(-0.25,2.375) 7(0.25,2.375) 8(0.75,2.375) 9(1.25,2.375) 10(1.75,2.375)
  oval 1.2x1.8 hole 0.6x1.2: 13(-4.325,-2.375) 14(4.325,-2.375)
  oval 1.1x2 hole 0.6x1.5: 13(-4.325,1.825) 14(4.325,1.825)

## Nets
As in the schematic.

Pads without a net: ENC201 1 2; FPC1 11 12; J101 3 9; U101 35 36 37

## Via types
v1: diameter 0.61, hole 0.305, Top Layer to Bottom Layer, 215 vias

## Routing (per net, layer and track width the routed paths; a pad name or vN(x,y) marks a point on that pad's centre or on a via; arc(x,y) is an arc through that point)
+1V1: length 43.5
  Top Layer w1.016: v1(43.94,163.41) 44.45,163.41 45.21,164.17 v1(45.21,167.98) 45.21,168.54 44.38,169.38 40.77,169.38 39.37,167.98 37.47,167.98 37.02,168.42 37.02,169.69 36.45,170.27 34.8,170.27 34.16,169.63 34.16,165.95 33.15,164.93 v1(30.61,164.93)
  Bottom Layer w0.205: U101.45 41.42,165.97 42.42,166.96 43.34,166.96 43.72,167.35 44.58,167.35 v1(45.21,167.98) ; U101.50 43.38,163.97 v1(43.94,163.41) 43.94,163.28 44.32,162.9 44.92,162.9 ; v1(30.61,164.93) 30.77,164.77 U101.23
  Bottom Layer w0.508: 29.5,165.95 29.59,165.95 v1(30.61,164.93) ; C107.2 v1(45.21,167.98)
+3V3: length 360.1
  Top Layer w0.406: 16.9,262.09 v1(18.29,262.09)
  Top Layer w1.016: 57.78,161.08 54.56,161.08 53.21,159.73 46.1,159.73 45.08,158.71 41.78,158.71 40.51,159.98 v1(40.51,160.87) ; 57.78,161.08 57.78,167.45 v1(57.53,167.7) ; 57.78,161.08 v1(57.78,159.09) ; v1(21.34,162.1) 23.46,159.98 29.5,159.98 ; v1(35.56,168.87) 35.56,167.09 36.28,166.37 39.79,166.37 v1(40.89,167.47) 41.91,167.47 ; v1(40.51,160.87) 40.51,162.52 v1(43.18,165.19) ; v1(40.51,160.87) 37.59,160.87 v1(35.31,158.58) 33.91,159.98 29.5,159.98 ; v1(43.18,165.19) 43.43,165.19 v1(43.94,164.68) ; v1(43.18,165.19) 43.94,165.95 v1(43.94,167.98) 42.44,167.98 v1(42.42,167.95) ; v1(20.7,166.46) 21.59,165.57 21.59,162.39 21.21,162.01 11.43,162.01 10.41,163.03 10.41,166.58 8.38,168.62 8.38,174.46 1.52,181.32 1.52,199.22 2.54,200.24 5.59,200.24 6.67,201.32 6.67,208.55 v1(6.6,208.62) ; 29.5,159.98 29.25,160.23 v1(29.25,164.93)
  Bottom Layer w0.205: v1(43.18,165.19) 42.76,164.77 U101.48 ; U101.42 39.74,167.72 39.88,167.85 40.39,167.85 ; 29.5,164.17 30.67,164.17 30.87,164.37 U101.22 ; v1(35.56,168.87) 35.83,168.6 U101.33 ; C115.2 35.83,159.55 U101.10 ; U101.49 43.63,164.37 v1(43.94,164.68) ; U101.44 41.22,166.37 42.2,167.35 43.18,167.35 43.81,167.98 v1(43.94,167.98) ; v1(40.51,160.87) 40.01,160.87 39.76,160.62 U101.1
  Bottom Layer w0.508: v1(20.7,166.46) 20.7,167.02 R123.2 ; C126.2 57.91,168.74 57.53,168.36 v1(57.53,167.7) U104.8 ; 16,237.7 16,241.64 14.99,242.66 R202.2 ; 43.18,168.82 43.18,168.36 42.8,167.98 42.42,167.98 ; v1(40.51,160.87) 40.51,160.36 41.02,159.85 C116.2 ; v1(35.56,168.87) 35.56,169.12 35.03,169.66 33.88,169.66 33.01,170.52 C113.2 ; 41.02,167.85 41.15,167.98 C104.2 ; 41.02,167.85 40.39,167.85 ; 41.02,167.85 40.89,167.73 v1(40.89,167.47) ; C101.2 v1(21.34,162.1) ; 32.32,237.7 32.32,241.83 33.02,242.53 33.02,243.38 33.56,243.38 34.29,242.66 35.13,242.66 ; v1(35.31,158.58) 35.78,158.58 C115.2 ; 6.92,237.7 6.92,241.83 7.62,242.53 C201.2 8.16,243.38 8.89,242.66 R201.2 ; v1(43.94,164.68) 44.7,163.92 44.92,163.92 ; v1(43.94,167.98) 44.2,168.23 C106.2 ; 44.92,165.44 43.43,165.44 v1(43.18,165.19) ; 57.78,237.7 58.55,237.7 60.45,239.61 ; 38.53,242.66 40.39,242.66 41.4,241.64 41.4,237.7 ; v1(29.25,164.93) 29.5,164.68 29.5,164.17 ; R122.2 v1(57.78,159.09) ; R104.2 27.56,261.38
  Bottom Layer w1.016: 18.29,262.09 19,261.38 27.56,261.38 ; 8,237.7 4.06,237.7 2.41,239.35 2.41,249.9 4.03,251.51 9.24,251.51 11.68,253.96 11.68,260.06 13.72,262.09 v1(18.29,262.09) ; 8,237.7 57.72,237.7 ; 8,237.7 8,217.89 6.48,216.37 6.48,208.75 v1(6.6,208.62) 6.6,206.66 C112.2 6.62,206.53 U102.3
  vias: v1(5.59,210.14) v1(5.59,208.62) v1(6.6,210.14)
+3V3_A: length 4.7
  Bottom Layer w0.205: R101.2 42.89,169.68 C105.2 41.78,168.58 41.78,167.47 41.08,166.77 U101.43
+5V_USB: length 10.8
  Bottom Layer w0.762: 2,205.1 1.52,205.57 1.52,206.46 ; 2,205.1 2,204.81 ; 2,205.1 2.02,205.07 ; U102.1 2.02,204.79
  Bottom Layer w1.016: 1.52,206.46 1.52,211.67 v1(2.79,211.67)
  vias: v1(4.06,211.67) v1(38.86,261.96) v1(38.86,260.69) v1(40.13,260.69) v1(58.42,263.23) v1(59.69,263.23) v1(60.96,263.23)
GND: length 94
  Top Layer w0.508: 24.13,262.76 v1(25.65,262.76) ; LED102.2 v1(30.23,262.76)
  Bottom Layer w0.205: U101.19 32.02,163.17 v1(31.5,162.65)
  Bottom Layer w0.508: 62.95,245.2 v1(62.95,246.21) ; 15.49,160.07 v1(14.48,160.07) ; v1(22.1,211.41) 23.08,211.41 23.11,211.45 ; 53.08,173.56 53.08,174.34 v1(52.58,174.84) ; 33.02,244.47 v1(33.91,244.47) ; v1(25.65,163.79) 25.1,164.34 Y101.4 ; 53.08,211.66 53.08,212.44 v1(52.58,212.94) ; v1(47.24,164.93) 47.24,164.3 46.86,163.92 C103.1 ; 10.7,245.2 v1(10.7,246.21) ; v1(43.18,170.77) 42.89,170.77 C105.1 ; v1(22.1,192.36) 23.08,192.36 23.11,192.4 ; v1(22.48,167.85) 22.52,167.81 Y101.2 ; 42.16,192.4 42.13,192.36 v1(41.15,192.36) ; v1(60.45,167.85) 60.45,168.36 60.07,168.74 59.98,168.74 ; v1(14.48,193.89) 14.98,193.39 14.98,192.61 ; 10.92,160.07 v1(9.91,160.07) ; 17.78,160.07 v1(16.76,160.07) ; 61.21,259.97 61.89,259.97 v1(62.23,260.31) ; C115.1 37.88,158.58 v1(38.35,158.58) ; 34.03,173.56 34.03,174.34 v1(33.53,174.84) ; v1(52.58,193.89) 53.08,193.39 53.08,192.61 ; 61.5,245.2 v1(61.5,246.21) ; v1(14.48,212.94) 14.98,212.44 14.98,211.66 ; C104.1 41.15,170.52 41.91,171.28 v1(42.16,171.28) ; 61.21,211.45 61.18,211.41 v1(60.2,211.41) ; v1(60.2,173.31) 61.18,173.31 61.21,173.35 ; C114.1 28.41,164.59 v1(28.07,164.93) ; D104.1 v1(51.3,259.46) ; 58.42,244.47 v1(59.31,244.47) ; C119.1 v1(57.15,264.25) ; C109.1 v1(27.3,165.95) ; 13.21,160.07 v1(12.19,160.07) ; 14.98,173.56 14.98,174.34 v1(14.48,174.84) ; C106.1 v1(44.2,171.03) ; R118.1 v1(53.09,256.99) ; SW101.2 v1(59.94,160.62) ; v1(48.77,162.65) 48.51,162.9 C108.1 ; C102.1 46.52,165.95 v1(47.24,165.95) ; J101.12 52.73,262.7 v1(53.34,262.09) ; v1(33.53,212.94) 34.03,212.44 34.03,211.66 ; C107.1 v1(45.21,171.03) ; v1(51.82,161.88) 51.82,160.87 52.04,160.64 U104.4 ; v1(3.05,208.11) 3.49,207.67 C112.1 ; SW102.2 18.72,164.86 v1(18.92,165.06) ; C116.1 v1(43.94,159.85) ; SW101.1 58.86,166.02 v1(59.18,165.69) ; 23.11,173.35 23.08,173.31 v1(22.1,173.31) ; v1(33.53,193.89) 34.03,193.39 34.03,192.61 ; R119.1 v1(45.97,256.99) ; C111.1 v1(4.06,204.81) 4.32,204.56 U102.2 ; C127.1 v1(23.11,168.96) ; 61.21,192.4 61.18,192.36 v1(60.2,192.36) ; 11.18,214.25 12.16,214.25 v1(12.57,213.83) ; D101.1 v1(43.18,264.2) ; C123.2 v1(25.15,161.34) ; C101.1 v1(20.32,164.21) ; v1(27.18,167.09) 26.76,167.51 C124.2 ; C204.1 v1(12.16,246.21) ; C118.1 v1(41.91,264.25) ; J101.1 46.33,262.7 v1(45.72,262.09) ; v1(41.15,211.41) 42.13,211.41 42.16,211.45 ; SW102.1 v1(12.06,164.86) ; C113.1 v1(30.73,170.52) ; 37.55,245.2 v1(37.55,246.21) ; 36.1,245.2 v1(36.1,246.21) ; v1(41.15,174.84) 42.13,174.84 42.16,174.88 ; D103.1 v1(47.76,259.46) ; D102.1 v1(55.88,264.2) ; C201.1 v1(8.51,244.47)
  Bottom Layer w1.016: U102.4 v1(4.32,194.4)
  vias: v1(2.79,194.4) v1(2.79,192.87) v1(2.79,191.35) v1(3.05,209.38) v1(4.06,209.38) v1(4.06,208.11) v1(4.32,192.87) v1(4.32,191.35) v1(5.84,194.4) v1(5.84,192.87) v1(5.84,191.35) v1(8.89,183.73) v1(10.92,224.11) v1(11.68,185) v1(12.95,203.79) v1(13.21,248.12) v1(17.4,166.46) v1(20.45,256.12) v1(20.57,187.61) v1(23.75,199.48) v1(23.75,179.92) v1(24.26,206.46) v1(25.53,256.12) v1(25.65,208.75) v1(26.8,223.73) v1(27.43,170.01) v1(30.73,207.86) v1(30.86,222.59) v1(30.86,184.36) v1(35.81,165.19) v1(35.81,163.15) v1(37.85,165.19) v1(37.85,163.15) v1(44.54,240.24) v1(46.51,242.94) v1(47.62,186.78) v1(48.51,257.64) v1(49.4,214.97) v1(49.4,196.05) v1(49.66,183.47) v1(50.04,243.93) v1(50.55,257.64) v1(51.44,169.12) v1(51.44,167.22) v1(52.96,242.91) v1(52.96,240.24) v1(55.75,164.81) v1(56.52,163.79) v1(62.74,214.04) v1(62.74,195.03) v1(62.74,186.4) v1(63.88,206.59)
(no net): length 286.5
  Top Layer w0.152: v1(45.21,172.55) 46.1,173.44 46.1,183.22 44.58,184.74 44.58,187.28 47.37,190.08 47.37,236.56 51.05,240.24 v1(51.05,242.91) ; v1(45.47,186.78) 45.47,185.38 46.86,183.98 46.86,168.11 v1(48.51,166.46) ; v1(8.89,184.74) 8.13,185.51 v1(8.13,196.17) 8.13,208.37 9.65,209.89 v1(9.65,214.46) 9.65,231.23 6.86,234.02 6.86,245.07 7.75,245.96 7.75,253.59 8.89,254.74
  Bottom Layer w0.152: 10.45,218.53 10.45,215.26 v1(9.65,214.46) ; 26.67,254.16 27.63,254.16 32.38,258.91 42.55,258.91 51.05,250.4 v1(51.05,242.91) ; v1(45.21,172.55) 44.58,172.55 44.32,172.81 42.04,172.81 39.37,170.14 37.81,170.14 37.43,169.76 U101.37 ; 10.45,199.48 10.45,197.22 9.4,196.17 8.25,196.17 ; 10.45,180.43 10.45,183.19 v1(8.89,184.74) 10.03,185.89 25.4,185.89 26.29,186.78 v1(45.47,186.78) ; U101.36 37.03,168.42 35.18,170.27 34.29,170.27 33.27,171.28 30.05,171.28 29.72,171.61 ; v1(48.51,166.46) 48.51,164.42 49.4,163.54 49.4,162.14 48.51,161.25 48.51,160.79 ; 13.97,252.72 13.97,254.74
COL0_R: length 10.9
  Bottom Layer w0.152: 48.51,159.93 47.68,159.09 39.79,159.09 39.03,159.85 U101.2
COL1_R: length 13
  Bottom Layer w0.152: U101.3 38.63,159.71 39.63,158.71 48.64,158.71 49.78,159.85 49.78,159.93
COL2: length 111.4
  Top Layer w0.152: v1(50.55,166.46) 48.51,168.49 v1(48.51,183.47) v1(48.51,196.94) v1(48.51,215.73) 48.51,236.05 52.07,239.61 v1(52.07,242.15)
  Bottom Layer w0.152: v1(48.51,183.47) 48.51,180.46 48.55,180.43 ; v1(48.51,196.94) 48.51,199.44 48.55,199.48 ; v1(52.07,242.15) 52.07,250.66 52.96,251.55 58.67,251.55 59.69,252.56 59.69,254.74 ; R112.2 51.05,164.68 50.55,165.19 v1(50.55,166.46) ; v1(48.51,215.73) 48.51,218.49 48.55,218.53
COL2_R: length 15
  Bottom Layer w0.152: U101.4 38.23,159.57 39.48,158.33 49.45,158.33 R112.1
COL8_R: length 29.5
  Bottom Layer w0.152: 10.92,162.47 10.92,161.16 11.56,160.52 11.56,158.96 12.19,158.33 34.16,158.33 35.43,159.6 U101.11
COL9_R: length 26.2
  Bottom Layer w0.152: U101.12 35.03,159.73 34.01,158.71 14.35,158.71 13.84,159.22 13.84,160.52 13.21,161.16 13.21,162.47
COL10_R: length 22.9
  Bottom Layer w0.152: 15.49,162.47 15.49,161.16 16.13,160.52 16.13,159.6 16.64,159.09 33.85,159.09 34.63,159.87 U101.13
COL11_R: length 19.6
  Bottom Layer w0.152: U101.14 34.23,160.01 33.69,159.47 18.92,159.47 18.41,159.98 18.41,160.49 17.78,161.13 17.78,162.47
CON_USB_N: length 132.1
  Top Layer w0.155: v1(50.55,168.74) 50.88,168.41 52.88,168.41 54.07,169.6 61.2,169.6 64.93,173.33 64.93,234.54 70.52,240.13 70.52,250.51 69.2,251.84 51.04,251.84 49.36,253.52 49.36,258.07 v1(49.02,258.4)
  Bottom Layer w0.155: v1(49.02,258.4) 49.36,258.74 49.36,259.84 D103.2 48.78,260.46 J101.5 48.78,263.88 49.02,264.12 49.53,264.12 49.78,263.87 J101.7 ; R109.1 v1(50.55,168.74)
CON_USB_P: length 131.9
  Top Layer w0.155: v1(50.55,167.73) 50.88,168.06 53.02,168.06 54.21,169.25 61.34,169.25 65.28,173.19 65.28,234.4 70.87,239.99 70.87,250.66 69.34,252.18 51.18,252.18 49.7,253.66 49.7,258.07 v1(50.04,258.4)
  Bottom Layer w0.155: v1(50.04,258.4) 49.7,258.74 49.7,259.84 D104.2 50.28,260.46 50.28,262.09 ; J101.8 50.28,262.09 ; 50.28,262.09 50.28,262.09 49.53,262.09 49.28,262.34 J101.6 ; R111.1 v1(50.55,167.73)
CS: length 141.1
  Top Layer w1.016: v1(2.79,212.94) 3.05,213.19 6.62,213.19 ; 6.62,213.19 7.11,213.69 7.11,217.13 8.13,218.15 8.13,225.64 2.41,231.35 2.41,251.17 11.3,260.06 11.3,263.87 12.7,265.26 38.23,265.26 40.13,263.36 v1(40.13,261.96) 41.27,260.82 58.55,260.82 59.94,262.21 v1(60.96,262.21) ; 6.62,213.19 v1(8.38,213.19)
  Bottom Layer w0.508: 47.13,263.14 47.13,262.1 46.23,261.2 44.2,261.2 43.18,262.22 43.13,262.18 41.91,262.18 41.69,261.96 v1(40.13,261.96) ; 11.36,211.5 11.36,212.25 11.18,212.44 11.18,213.16 8.42,213.16 v1(8.38,213.19) ; 51.93,263.14 51.93,262.23 52.96,261.2 54.86,261.2 55.88,262.22 57.11,262.22 57.15,262.18 59.17,262.18 59.44,261.92 60.66,261.92 v1(60.96,262.21)
  vias: v1(4.06,212.94)
ENC1_B: length 113.5
  Top Layer w0.152: v1(63.75,246.97) 62.99,247.74 59.94,247.74 57.78,245.58 46.61,245.58 42.04,241.01 42.04,220.05 39.62,217.64 39.62,207.86 41.91,205.57 41.91,200.87 39.62,198.59 39.62,189.06 34.54,183.98 32,183.98 29.97,181.95 29.97,179.54 29.34,178.9 29.34,176.11 30.99,174.46 30.99,172.3 32,171.28 v1(32,169.5)
  Bottom Layer w0.152: 63.93,243.93 64.05,244.04 64.05,245.2 63.75,245.49 v1(63.75,246.97) ; v1(32,169.5) 33.27,169.5 33.66,169.12 34.45,169.12 35.03,168.54 U101.31
QSPI_SCLK: length 20.2
  Top Layer w0.152: v1(52.7,162.39) 52.7,161.5 52.2,161 44.32,161 v1(42.93,162.39)
  Bottom Layer w0.152: U104.6 53.97,165.57 53.59,165.19 53.59,164.17 52.7,163.28 v1(52.7,162.39) ; U101.52 42.15,163.17 v1(42.93,162.39)
QSPI_SD0: length 16.9
  Top Layer w0.152: v1(44.7,161.88) 44.89,161.88 46.55,163.54 47.37,163.54 48.89,165.06 v1(52.7,165.06)
  Bottom Layer w0.152: v1(44.7,161.88) 44.45,161.63 42.7,161.63 41.56,162.77 U101.53 ; U104.5 v1(52.7,165.06)
QSPI_SD1: length 19.3
  Top Layer w0.152: v1(55.25,163.15) 54.48,163.15 53.85,163.79 49.02,163.79 47.75,162.52 47.37,162.52 v1(46.74,161.88)
  Bottom Layer w0.152: v1(46.74,161.88) 45.72,160.87 42.32,160.87 41.22,161.97 U101.55 ; U104.2 v1(55.25,163.15)
QSPI_SD2: length 20.1
  Top Layer w0.152: v1(54.61,164.42) 49.02,164.42 47.62,163.03 46.86,163.03 v1(45.72,161.88)
  Bottom Layer w0.152: U101.54 41.42,162.37 42.55,161.25 45.08,161.25 v1(45.72,161.88) ; U104.3 53.97,163.15 54.61,163.79 v1(54.61,164.42)
QSPI_SD3: length 18.7
  Top Layer w0.152: v1(43.94,162.39) 44.02,162.47 44.78,162.47 46.36,164.04 47.24,164.04 48.77,165.57 51.69,165.57 51.94,165.82 v1(55.25,165.82)
  Bottom Layer w0.152: U104.7 v1(55.25,165.82) ; U101.51 42.76,163.57 v1(43.94,162.39)
QSPI_SS: length 28.5
  Top Layer w0.152: v1(47.75,161.88) 49.15,161.88 50.42,163.15 53.47,163.15 54.23,162.39 v1(56.52,162.39)
  Bottom Layer w0.152: U101.56 41.08,161.57 42.16,160.49 46.36,160.49 v1(47.75,161.88) ; v1(56.52,162.39) U104.1 57.3,160.64 57.66,161 57.66,161.76 58.04,162.14 60.71,162.14 61.09,161.76 61.09,159.8 R124.2
RESET_N: length 15.3
  Bottom Layer w0.152: R125.2 21.08,168.74 22.39,170.05 C127.2 25.24,170.05 26.8,168.49 29.46,168.49 31.98,165.97 U101.26
ROW0: length 118
  Top Layer w0.152: v1(12.19,163.41) 12.83,164.04 12.83,172.04 8.51,176.36 8.51,182.33 10.16,183.98 10.16,186.4 9.02,187.54 9.02,203.54 10.92,205.45 v1(10.92,222.59)
  Bottom Layer w0.152: v1(12.19,163.41) 12.12,163.33 10.92,163.33 ; D203.1 59.28,224.11 47.6,224.11 D202.1 43.84,224.11 29.31,224.11 27.43,222.24 D201.1 24.79,224.11 12.45,224.11 v1(10.92,222.59)
ROW1: length 100.9
  Top Layer w0.152: v1(11.43,203.54) 10.03,202.14 10.03,188.05 10.92,187.16 10.92,183.47 9.4,181.95 9.4,176.49 13.59,172.3 13.59,164.04 v1(14.22,163.41)
  Bottom Layer w0.152: v1(11.43,203.54) 12.45,204.56 25.3,204.56 D204.1 30.38,203.19 31.5,204.3 44.61,204.3 D205.1 46.83,204.3 63.66,204.3 D206.1 ; 13.21,163.33 14.15,163.33 v1(14.22,163.41)
ROW2: length 80.5
  Top Layer w0.152: v1(12.95,185) 12.95,184.24 10.29,181.57 10.29,176.74 14.35,172.68 14.35,165.57 v1(16.51,163.41)
  Bottom Layer w0.152: v1(12.95,185) 25.81,185 D207.1 28.99,184.14 30.1,185.25 44.61,185.25 D208.1 47.78,184.14 49.15,185.51 63.4,185.51 D209.1 ; v1(16.51,163.41) 16.44,163.33 15.49,163.33
ROW2_R: length 119
  Top Layer w0.152: v1(9.65,246.97) 10.92,246.97 11.43,246.47 11.43,245.58 11.94,245.07 14.6,245.07 18.54,241.13 18.54,225 19.43,224.11 22.86,224.11 24.51,222.46 24.51,211.03 22.61,209.13 22.61,200.62 20.57,198.59 20.57,189.19 22.61,187.16 22.61,181.32 20.57,179.28 20.57,171.03 18.54,169 v1(18.54,166.46)
  Bottom Layer w0.152: U101.18 32.51,162.77 30.1,160.36 20.32,160.36 19.56,161.12 19.56,165.44 v1(18.54,166.46) ; v1(9.65,246.97) 9.65,245.23 9.61,245.2 9.73,245.08 9.73,243.93
ROW3: length 178.6
  Top Layer w0.152: v1(13.97,249.01) 9.78,249.01 8.89,248.12 8.89,245.32 10.01,244.2 13.95,244.2 17.53,240.62 17.53,220.43 20.95,217 20.95,208.49 15.37,202.91 12.32,202.91 10.92,201.51 10.92,188.81 13.84,185.89 13.84,183.86 11.18,181.19 11.18,177 15.11,173.06 15.11,167.09 v1(18.8,163.41)
  Bottom Layer w0.152: 64.77,250.37 55.34,250.37 54.23,249.26 54.23,241.77 53.59,241.13 45.34,241.13 44.58,241.89 44.58,249.51 43.72,250.37 13.97,250.37 v1(13.97,249.01) ; 17.78,163.33 18.72,163.33 v1(18.8,163.41)
ROW3_R: length 101.6
  Top Layer w0.152: v1(13.21,246.97) 14.35,246.97 19.3,242.02 19.3,225.38 19.81,224.88 23.24,224.88 25.4,222.72 25.4,210.78 23.49,208.87 23.49,200.49 21.34,198.33 21.34,189.57 23.37,187.54 23.37,181.06 21.34,179.03 21.34,175.35 v1(24.38,172.3)
  Bottom Layer w0.152: v1(24.38,172.3) 24.38,172.04 27.3,169.12 29.59,169.12 32.34,166.37 U101.27 ; v1(13.21,246.97) 13.21,245.23 13.24,245.2 13.24,244.04 13.13,243.93
RS: length 1.3
  Bottom Layer w0.508: 9.46,209.3 9.46,208.05 v1(9.4,207.99)
RSTB: length 131
  Top Layer w0.152: v1(43.94,172.04) 43.94,172.81 45.34,174.2 45.34,182.59 43.81,184.11 43.81,187.92 46.23,190.33 46.23,237.2 50.04,241.01 v1(50.04,242.15)
  Bottom Layer w0.152: U101.40 38.63,168.38 38.86,168.62 39.5,168.62 40.13,169.25 40.13,170.27 41.91,172.04 v1(43.94,172.04) ; 9.46,211.5 9.46,210.84 9.91,210.4 12.7,210.4 12.95,210.14 14.97,210.14 14.98,210.16 ; 21.84,254.16 21.84,253.07 23.37,251.55 28.83,251.55 33.4,256.12 40.64,256.12 45.72,251.04 45.72,242.66 46.23,242.15 v1(50.04,242.15)
SCL: length 178.3
  Top Layer w0.152: v1(39.37,169.5) 44.45,174.58 44.45,182.08 43.05,183.47 43.05,188.55 45.21,190.71 45.21,237.83 49.02,241.64 v1(49.02,242.91) ; v1(29.72,173.44) 29.72,174.33 28.45,175.6 28.45,179.03 29.21,179.79 29.21,182.59 29.72,183.09 v1(29.72,207.86)
  Bottom Layer w0.152: 29.72,172.48 v1(29.72,173.44) ; U101.39 38.23,168.75 38.48,169 38.86,169 v1(39.37,169.5) ; 11.36,209.3 10.41,209.3 10.41,208.37 10.92,207.86 v1(29.72,207.86) ; v1(49.02,242.91) 47.62,242.91 46.86,243.67 46.86,251.42 41.27,257.01 33.15,257.01 28.58,252.44 23.88,252.44 23.11,253.2 23.11,254.16
SDA: length 118.5
  Top Layer w0.152: v1(48.01,243.93) 48.01,242.28 44.2,238.47 44.2,191.22 42.04,189.06 42.04,182.97 43.56,181.44 43.56,174.97 v1(38.1,169.5)
  Bottom Layer w0.152: v1(38.1,169.5) 37.83,169.23 U101.38 ; v1(48.01,243.93) 48.01,251.93 42.04,257.9 32.77,257.9 28.07,253.2 24.77,253.2 24.38,253.58 24.38,254.16
SWCLK: length 89.8
  Top Layer w0.152: v1(24.64,205.57) 24.64,173.7 25.4,172.93 25.4,169.76 27.43,167.73 v1(27.94,167.73)
  Bottom Layer w0.152: v1(27.94,167.73) 28.96,166.71 29.84,166.71 31.38,165.17 U101.24 ; J102.1 66.55,205.06 26.16,205.06 25.65,205.57 v1(24.64,205.57)
SWDIO: length 89.3
  Top Layer w0.152: v1(28.96,167.73) 28.96,168.23 28.45,168.74 27.69,168.74 26.54,169.89 26.54,173.44 25.65,174.33 v1(25.65,206.33)
  Bottom Layer w0.152: J102.3 64.77,205.83 27.18,205.83 26.67,206.33 v1(25.65,206.33) ; U101.25 31.62,165.57 30.1,167.09 29.59,167.09 v1(28.96,167.73)
USB_N: length 9.8
  Bottom Layer w0.155: 48.84,168.74 48.41,168.74 48.07,168.41 46.91,168.41 44.96,166.46 42.93,166.46 42.01,165.54 41.11,165.54 41.09,165.57 U101.46
USB_P: length 9.8
  Bottom Layer w0.155: U101.47 41.09,165.17 41.11,165.2 42.16,165.2 43.07,166.11 45.1,166.11 47.05,168.06 48.07,168.06 48.41,167.73 48.84,167.73
X_R: length 3.5
  Bottom Layer w0.152: R121.1 26.24,166.34 C124.1 24.34,166.42 Y101.3
XIN: length 13.1
  Bottom Layer w0.152: Y101.1 22.52,163.12 23.2,162.43 C123.1 27.14,162.43 27.61,161.96 R120.2 29.82,161.96 31.44,163.57 U101.20
XOUT: length 8.3
  Bottom Layer w0.152: U101.21 31.17,163.97 30.02,162.83 R120.1 27.89,162.83 27.1,163.61 R121.2
$1N6734: length 5.1
  Bottom Layer w0.152: J101.10 51.28,261.61 53.09,259.8 R118.2
$1N6739: length 5.3
  Bottom Layer w0.152: J101.4 48.28,262.11 45.97,259.8 R119.2
$1N8227: length 12.1
  Bottom Layer w0.152: R122.1 59.69,159.09 60.45,158.33 62.36,158.33 62.66,158.63 R124.1 62.66,160.51 SW101.4 SW101.3
$1N8669: length 10.8
  Bottom Layer w0.152: R125.1 R123.1 17.65,167.47 17.27,167.86 SW102.4 SW102.3
$1N9334: length 3.1
  Top Layer w0.152: LED102.1 v1(29.97,260.66)
  Bottom Layer w0.152: 29.97,260.69 29.79,260.51 R104.1
$2N527: length 3.3
  Bottom Layer w0.152: 23.9,221.07 25.5,221.07 D201.2
$2N632: length 3.3
  Bottom Layer w0.152: D202.2 44.55,221.07 42.95,221.07
$2N737: length 4.3
  Bottom Layer w0.152: 62,221.07 62.64,221.71 D203.2
$2N1048: length 3.3
  Bottom Layer w0.152: 23.9,202.02 25.5,202.02 D204.2
$2N1050: length 3.3
  Bottom Layer w0.152: D205.2 44.55,202.02 42.95,202.02
$2N1052: length 3.3
  Bottom Layer w0.152: 62,202.02 63.6,202.02 D206.2
$2N1363: length 3.3
  Bottom Layer w0.152: D207.2 25.5,182.97 23.9,182.97
$2N1365: length 3.3
  Bottom Layer w0.152: D208.2 44.55,182.97 42.95,182.97
$2N1367: length 3.3
  Bottom Layer w0.152: D209.2 63.6,182.97 62,182.97
$2N1909: length 4.4
  Bottom Layer w0.152: R205.2 R201.1 10.59,241.94 8.89,240.24
$2N1913: length 4.4
  Bottom Layer w0.152: 13.97,240.24 12.27,241.94 R202.1 R207.2

## Copper pours and planes (outline as drawn; the poured copper is in the pictures)
+3V3 on Top Layer: 5.21,210.53 5.21,208.24 7.49,208.24 7.49,210.53
+3V3 on Top Layer: 20.07,167.09 25.05,167.09 28.17,163.97 33.58,163.97 35.05,165.44 35.05,167.09 40.26,167.09 40.89,167.73 44.2,167.73 44.2,165.06 42.15,163.01 42.15,160.22 40.13,158.2 20.07,158.2
+3V3 on Bottom Layer: 5.21,210.53 7.49,210.53 7.49,201 5.84,201 5.84,207.6 5.21,208.24
+5V_USB on Top Layer: 38.23,262.47 56.64,262.47 57.91,263.74 61.47,263.74 61.47,259.42 38.23,259.42
+5V_USB on Top Layer: 1.02,216.37 8.89,216.37 8.89,211.16 1.02,211.16
+5V_USB on Bottom Layer: 44.45,262.47 44.45,260.18 38.23,260.18 38.23,262.47
+5V_USB on Bottom Layer: 61.47,261.2 61.47,263.74 57.91,263.74 57.91,262.47 54.61,262.47 54.61,260.82 57.66,260.82 57.66,261.2
+5V_USB on Bottom Layer: 1.02,213.32 4.45,213.32 4.45,211.16 1.02,211.16
GND on Bottom Layer: 2.67,209.76 4.45,209.76 4.45,205.45 4.95,204.94 4.95,199.73 6.22,199.73 6.22,190.97 1.02,190.97 1.02,199.73 3.68,199.73 3.68,203.92 3.43,204.18 2.67,204.18
GND on Inner1: 0.26,269.07 73.4,269.07 73.4,157.82 0.26,157.82
GND on Inner2: 0.26,269.07 73.4,269.07 73.4,157.82 0.26,157.82

Small or netless copper shapes (teardrops, artwork), in the pictures only: 86 on Inner1, 86 on Inner2

## Text on the board
Bottom Silkscreen Layer: MYKEYBOARD V1.0 | (C)2025 FEDEVEL | RESET | BOOT | www.fedevel.com | LEARN HOW TO DESIGN BOARDS | FEDEVEL ONLINE COURSES
Document Layer: Custom Keyboard © 2025 by FEDEVEL / is licensed under Creative Commons / Attribution-NonCommercial-ShareAlike 4.0 International / https://creativecommons.org/licenses/by-nc-sa/4.0/
Top Silkscreen Layer: RGB | USER | POWER
